# EAGLE design owc-receiver-v5 (EAGLE 8.6.0)
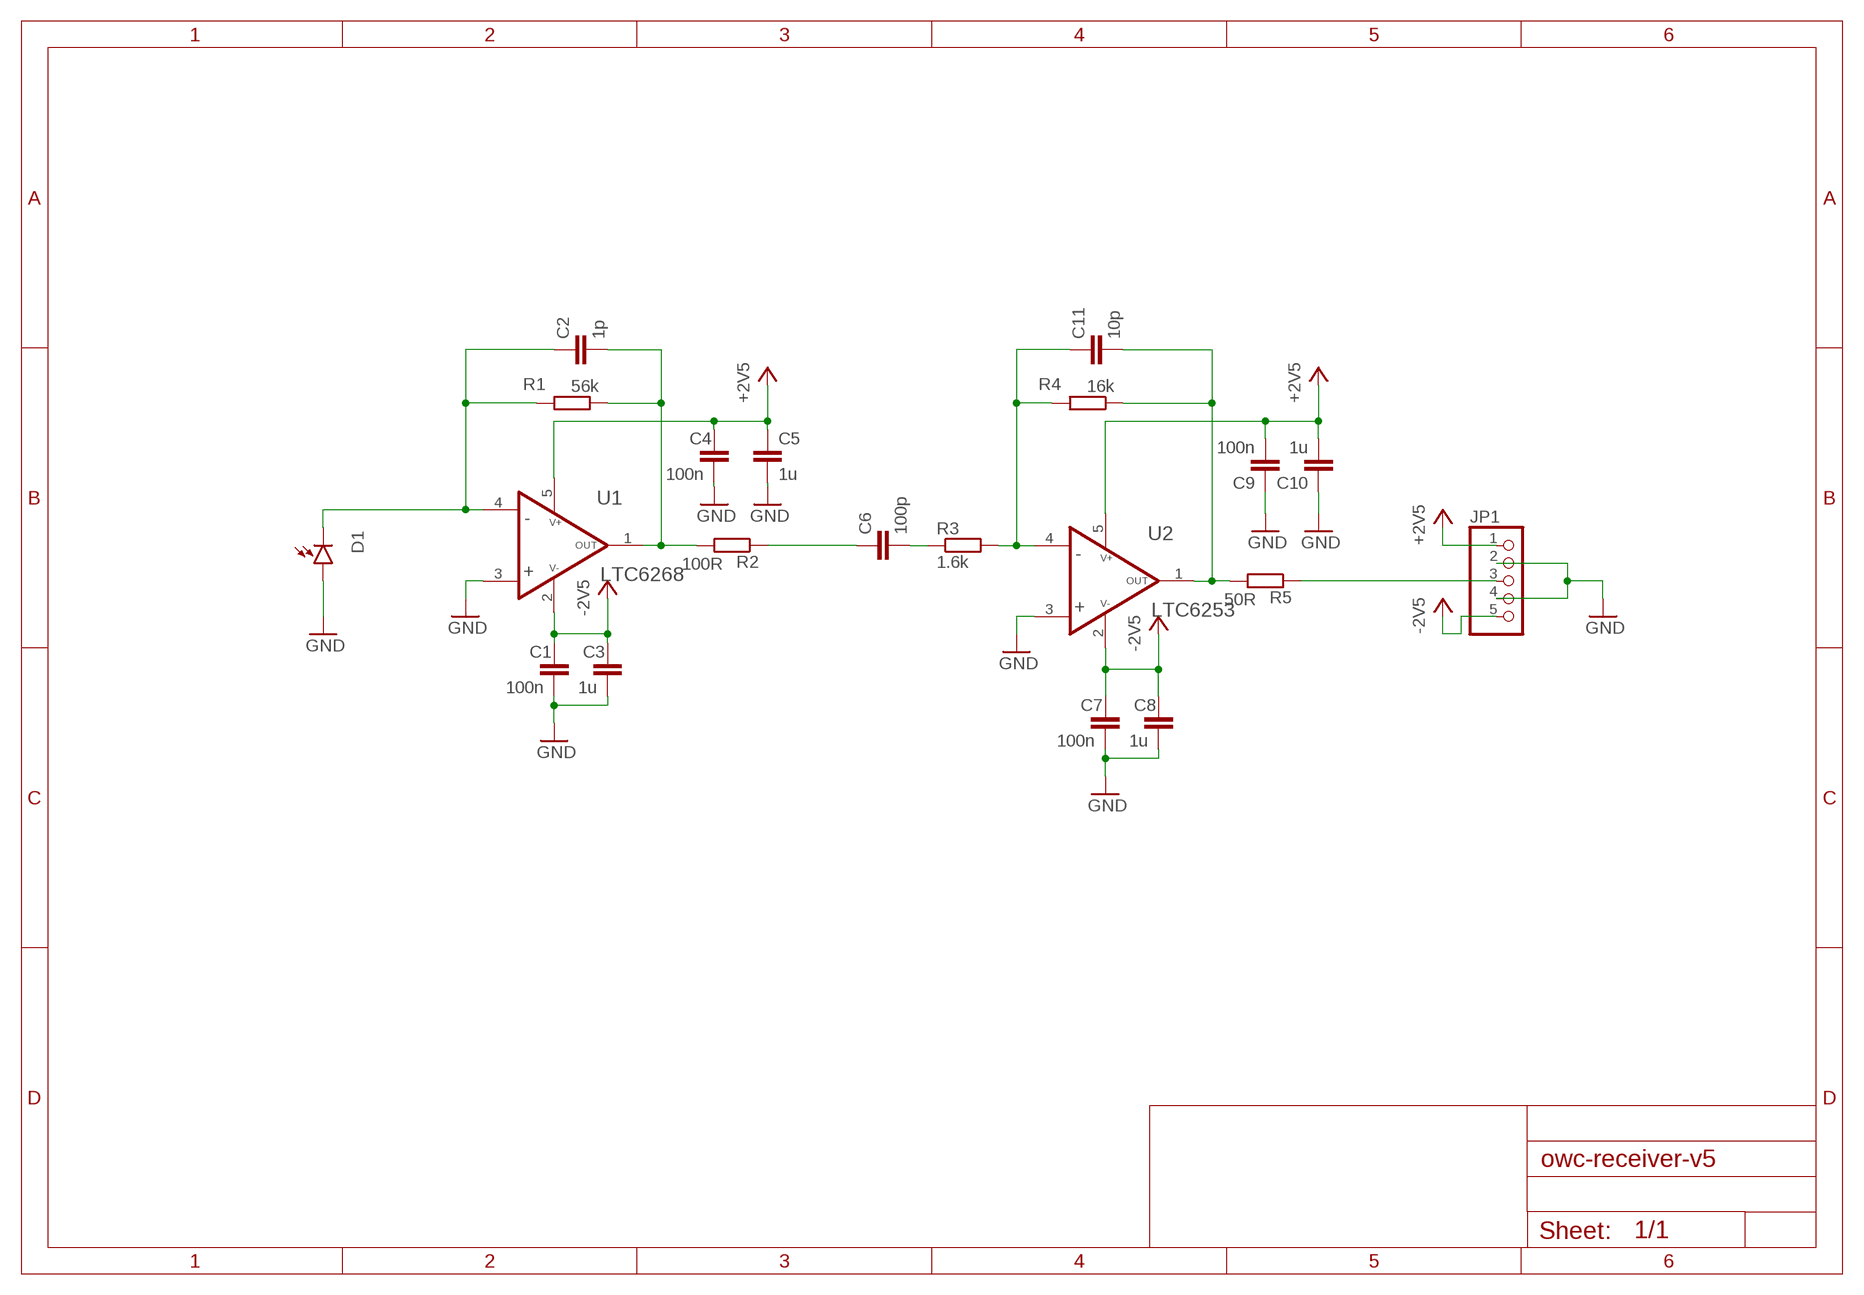
[diagram p0: schematic, sheet 1]

## Parts
C1  100n  C-EUC0805  [C0805]
C2  1p  C-EUC0805  [C0805]
C3  1u  C-EUC0805  [C0805]
C4  100n  C-EUC0805  [C0805]
C5  1u  C-EUC0805  [C0805]
C6  100p  C-EUC0805  [C0805]
C7  100n  C-EUC0805  [C0805]
C8  1u  C-EUC0805  [C0805]
C9  100n  C-EUC0805  [C0805]
C10  1u  C-EUC0805  [C0805]
C11  10p  C-EUC0805  [C0805]
D1  PHOTODIODE5MM  [LED5MM]
JP1  PINHD-1X5  [1X05]
R1  56k  R-EU_R0805  [R0805]
R2  100R  R-EU_R0805  [R0805]
R3  1.6k  R-EU_R0805  [R0805]
R4  16k  R-EU_R0805  [R0805]
R5  50R  R-EU_R0805  [R0805]
U1  LTC6268  LMH6629MF  [SOT23-5L]
U2  LTC6253  LMH6629MF  [SOT23-5L]

## Nets
+2V5: C4.1 C5.1 C9.2 C10.2 JP1.1 U1.5(V+) U2.5(V+)
-2V5: C1.1 C3.1 C7.1 C8.1 JP1.5 U1.2(V-) U2.2(V-)
GND: C1.2 C3.2 C4.2 C5.2 C7.2 C8.2 C9.1 C10.1 D1.A JP1.2 JP1.4 U1.3(IN+) U2.3(IN+)
N$1: C11.2 R4.1 R5.2 U2.1(OUT)
N$2: C2.2 R1.1 R2.2 U1.1(OUT)
N$3: C6.1 R2.1
N$4: C6.2 R3.1
N$5: C2.1 D1.K(C) R1.2 U1.4(IN-)
N$7: C11.1 R3.2 R4.2 U2.4(IN-)
N$16: JP1.3 R5.1

## Library data of the parts
C1-C11 = resistor:C-EU: CAPACITOR, European symbol
D1 = misc-parts:PHOTODIODE: LEDs Standard schematic elements and footprints for 5mm, 3mm, 1206, and 0603 sized LEDs. 5mm - Spark Fun Electronics SKU : COM-00529 (and others)
JP1 = pinhead+:PINHD-1X5: PIN HEADER
R1-R5 = resistor:R-EU_: RESISTOR, European symbol
U1 U2 = misc-parts:LMH6629

## Board
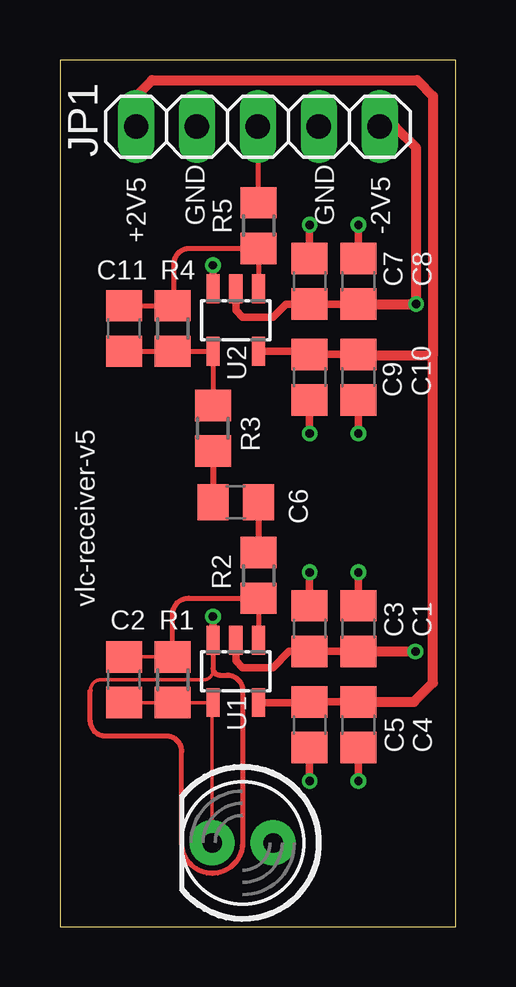
[diagram p1: board, top side]
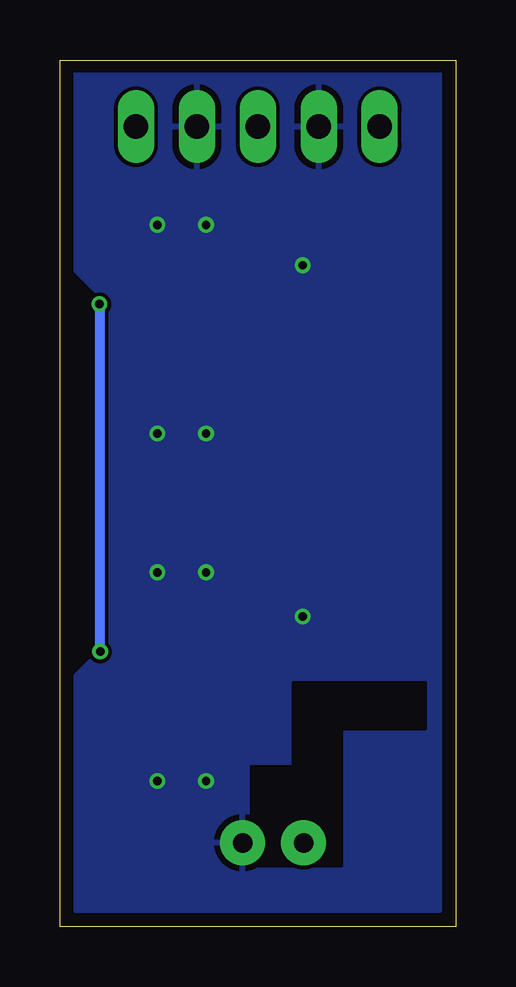
[diagram p2: board, bottom side, seen from below]

Size 16.51 x 36.11 mm. Coordinates in mm from the lower left corner, seen from the top.
Outline: 0,0 16.51,0 16.51,36.11 0,36.11 0,0
Copper layers (1*16): Top 0.035mm / dielectric 1.6mm / Bottom 0.035mm
Design rules "Elecrow-2-layer_PCB_eagle_rule": minimum track width 6mil, minimum drill 12mil, track to track 6mil, track to pad 8mil, pad to pad 12mil, via to via 12mil, smd to smd 0mil, copper to edge 20mil, drill to drill 10mil, minimum pad ring 6mil, minimum via ring 6mil, stop-mask expansion 0mil, vias tented up to drill 100mil, thermal gap 10mil

### Footprints (pad centres in the part's own frame; a part is rotated, then mirrored left to right if it is on the bottom)
C0805 = smd 1.3 x 1.5: 1 -0.95,0; 2 0.95,0
LED5MM = drill 0.813 pad 1.88: A -1.27,0; K 1.27,0
1X05 = drill 1.016 long: 1 -5.08,0; 2 -2.54,0; 3 0,0; 4 2.54,0; 5 5.08,0
R0805 = smd 1.3 x 1.5: 1 -0.95,0; 2 0.95,0
SOT23-5L = smd 0.55 x 1.2: 1 -0.95,-1.3; 2 0,-1.3; 3 0.95,-1.3; 4 0.95,1.3; 5 -0.95,1.3

### Placement (x,y rotation side)
C1  12.45,12.41 90 top
C2  2.67,10.29 90 top
C3  10.41,12.41 90 top
C4  12.45,8.41 270 top
C5  10.41,8.41 270 top
C6  7.33,17.68 180 top
C7  10.41,26.89 90 top
C8  12.45,26.89 90 top
C9  10.41,22.89 90 top
C10  12.45,22.89 90 top
C11  2.67,24.92 90 top
D1  7.62,3.49 180 top
JP1  8.26,33.34 0 top
R1  4.7,10.29 270 top
R2  8.29,14.64 270 top
R3  6.38,20.76 90 top
R4  4.7,24.92 270 top
R5  8.29,29.21 270 top
U1  7.33,10.64 180 top
U2  7.33,25.27 180 top

### Tracks (layer width: path | path; a pad name or v marks a point on that pad's centre or on a via)
+2V5
  Top 0.203: U2.5
  Top 0.305: U2.5 10.28,23.97 C9.2 C10.2 | U1.5 10.39,9.34 C5.1 C4.1
  Top 0.406: C10.2 12.47,23.81 15.56,23.81 | 15.56,23.81 15.56,10.16 14.76,9.36 C4.1 | JP1.1 3.17,34.61 3.83,35.27 14.9,35.27 15.56,34.61 15.56,23.81
-2V5  (via drill 0.35)
  Top 0.305: C8.1 C7.1 9.43,25.94 8.89,25.4 7.62,25.4 7.33,25.69 U2.2 | U1.2 7.33,11.08 7.62,10.79 8.89,10.79 9.56,11.46 C3.1 C1.1
  Top 0.406: C1.1 v14.82,11.46 v14.83,11.46 | C8.1 v14.86,25.94 14.86,32.45 13.97,33.34 JP1.5
  Bottom 0.406: v14.86,25.94 14.86,11.49 v14.83,11.46
GND  (via drill 0.35)
  Top 0.152: 1.27,9.84 arc-90 1.71,10.29 6,10.29 arc90 6.38,10.67 6.38,10.76
  Top 0.203: U1.3 6.38,10.76 arc90 6.67,10.48 6.99,10.48 arc-90 7.62,9.84 7.62,3.49 arc-90 6.35,2.22 arc-90 5.08,3.49 5.08,7.3 arc90 4.45,7.94 1.91,7.94 arc-90 1.27,8.57 1.27,9.84
  Top 0.305: C3.2 v10.41,14.76 | C1.2 v12.45,14.76 | v6.38,12.92 U1.3 | v6.38,27.56 U2.3 | v10.41,29.24 C7.2 | v12.45,29.24 C8.2 | C9.1 v10.41,20.54 | C5.2 v10.41,6.06 | C4.2 v12.45,6.06 | C10.1 v12.45,20.54
  pour Bottom: 0.64,35.56 15.88,35.56 15.88,27.3 14.92,26.35 14.92,11.43 15.88,10.48 15.88,0.64 0.64,0.64
N$1
  Top 0.203: U2.1 R5.2 5.4,28.26 arc90 4.76,27.62 4.76,25.94 arc-90 R4.1 C11.2
N$2
  Top 0.152: C2.2 R1.1
  Top 0.203: U1.1 | U1.1 | R2.2 R2.2 arc90 R2.2 | R2.2 U1.1 | R1.1 4.7,13.02 arc-90 5.37,13.68 R2.2 arc90 R2.2
N$3
  Top 0.254: C6.1 R2.1
N$4
  Top 0.203: 6.07,19.81 R3.1
  Top 0.254: R3.1 C6.2
N$5
  Top 0.152: 2.6,9.34 C2.1 R1.2 U1.4 arc90 6.35,9.3 D1.K
N$7
  Top 0.203: U2.4 arc90 U2.4 | R3.2 U2.4 | U2.4 R4.2 C11.1
N$12
  cutout Bottom (rank 2): 6.76,10.16 6.76,6.67 8.51,6.67 8.51,2.54 4.76,2.54 4.76,8.26 1.27,8.26 1.27,10.16
N$16
  Top 0.203: JP1.3 8.26,30.19 R5.1

### Text on the board
tNames: +2V5 | -2V5 | GND | GND | vlc-receiver-v5